# Altium schematic sheet Master_Transmit.SchDoc
size A4; Organization: Altium Limited; Address1: L3, 12a Rodborough Rd; Address2: Frenchs Forest; Address3: NSW; Address4: Australia 2086
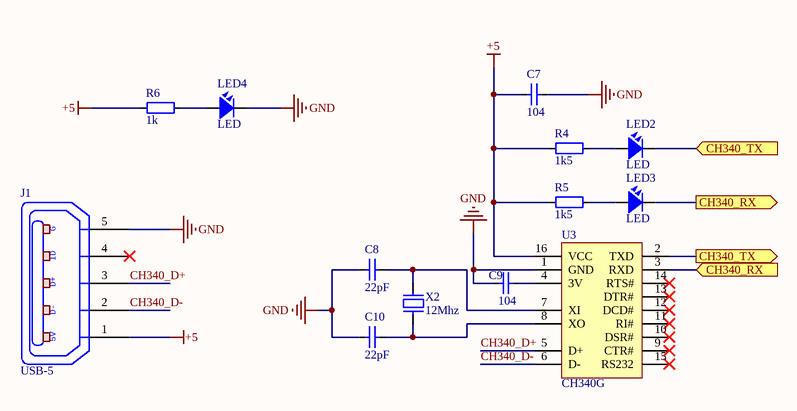
[diagram p0: Master_Transmit.SchDoc]

## Parts
C7  104  [CAP_0805]
C8  22pF  [CAP_0805]
C9  104  [CAP_0805]
C10  22pF  [CAP_0805]
J1  USB-5  [USB-M1]
LED2  LED  [LED-0805-Green]
LED3  LED  [LED-0805-Blue]
LED4  LED  [LED-0805-Red]
R4  1k5  [RES-SMD-0805]
R5  1k5  [RES-SMD-0805]
R6  1k  [RES-SMD-0805]
U3  CH340G  [SO16]
X2  12Mhz  [XT2]

## Ports
CH340_RX (in), CH340_RX (out), CH340_TX (in), CH340_TX (out)

## Nets
+5: C7.1 J1.1(P1) R4.2 R5.2 R6.2 U3.16(VCC)
GND: C7.2 C8.1 C9.1 C10.1 J1.5(P5) LED4.2 U3.1(GND)
CH340_D+: J1.3(P3) U3.5(D+)
CH340_D-: J1.2(P2) U3.6(D-)
CH340_RX: LED3.2 U3.3(RXD) ; port CH340_RX
CH340_TX: LED2.2 U3.2(TXD) ; port CH340_TX
NetC8_2: C8.2 U3.7(XI) X2.2
NetC9_2: C9.2 U3.4(3V)
NetC10_2: C10.2 U3.8(XO) X2.1
NetLED2_1: LED2.1 R4.1
NetLED3_1: LED3.1 R5.1
NetLED4_1: LED4.1 R6.1

Not connected (* = marked no-connect by the designer): J1 4(P4)*; U3 9(CTR#)* 10(DSR#)* 11(RI#)* 12(DCD#)* 13(DTR#)* 14(RTS#)* 15(RS232)*

## Notes on the sheet
- Labels drawn without touching a wire or pin: Page Contents:, Project:
- Size:
- Date:
- A4
- Ver:
- Time:
- Author:
- Checked by:
- File:
- (in symbol USB-5) G; ID; D+; D-; 5V

## Library data of the parts
C7-C10 = CapSMD: Capacitor; Value: 33p; Published: 8-Jun-2000; LatestRevisionDate: 17-Jul-2002; LatestRevisionNote: Re-released for DXP Platform.; PackageReference: RAD-0.3; Publisher: Altium Limited
J1 = USB-5: Manufacturer: FCI; Manufacturer Part Number: 10118193-0001LF; Connector Type: USB - micro B; Number of Contacts: 5; Gender: Receptacle; Specifications: USB 2.0; .Creator: MM; .Checked PCB: RF; Supplier 1: Digi-Key; RoHS: RoHS Compliant; Category: Connectors, Interconnects; Stock 1: 28642; Pricing 1: 1=0.46, 10=0.433, 25=0.3712, 50=0.3156, 100=0.3032, 250=0.27224, 500=0.25988 (USD); Packaging: Cut Tape (CT); Mounting Type: Surface Mount, Right Angle, Horizontal; Features: Shielded, Solder Retention; Ingress Protection: -; ComponentLink1URL: http://portal.fciconnect.com/Comergent//fci/drawing/10118193.pdf; ComponentLink1Description: http://portal.fciconnect.com/Comergent//fci/drawing/10118193.pdf; Supplier Part Number 1: 609-4616-1-ND; .Checked SCH: MM
LED2-LED4 = LED: LED Single colour Green and Red; Value: LED 3 ly Single Colour
R4-R6 = Resistor - SMD: Resistor; Manufacturer: Generic Components; Class: Passive; Published: 08/06/2000; Publisher: Altium Hobart Technology Centre
U3 = CH340G: High and Low Side Driver; Note: Pins 4, 8 and 14 are not connected; Published: 8-Jun-2000; LatestRevisionDate: 04-Mar-2005; LatestRevisionNote: Stylized 3D Model Added.; DatasheetVersion: PD60147J; PackageReference: PDIP14; Publisher: Altium Limited; PackageDescription: DIP; 14 Leads; Row Spacing 7.62 mm; Pitch 2.54 mm; ComponentLink1Description: Manufacturer Link; ComponentLink1URL: http://www.irf.com/; ComponentLink2Description: Datasheet; ComponentLink2URL: http://www.irf.com/product-info/datasheets/data/ir2110.pdf
X2 = XT2: Crystal For all Crystal 2pin.; Value: 4Mhz